# Altium schematic sheet Revision_Changes.SchDoc: TEBF0808 - Revision history
size A4; Organization: Trenz Electronic GmbH; DocumentNumber: TEBF0808; Revision: 04; SheetNumber: 36; SheetTotal: 36; Date: 2016-09-29; CompanyName: Trenz Electronic GmbH; PageSetup: Record=PageOptions|CenterHorizontal=True|CenterVertical=True|PrintScale=0.98|XCorrection=1.00|YCorrection=1.00|PrintKind=1|BorderSize=5000000|LeftOffset=0|BottomOffset=0|Orientation=2|PaperLength=1000|PaperWidth=1000|Scale=100|PaperSource=257|PrintQuality=600|MediaType=1|DitherType=10|PrintScaleMode=1|PaperKind=A4|PaperIndex=9
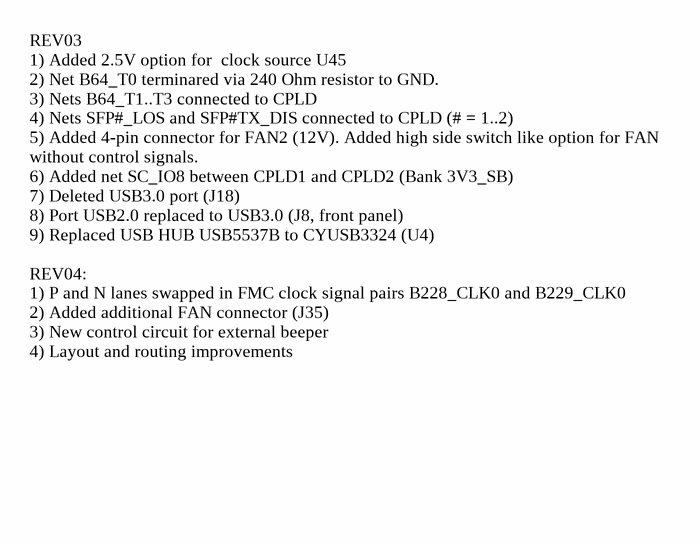
[diagram p0: Revision_Changes.SchDoc]

## Notes on the sheet
- REV03
  1) Added 2.5V option for  clock source U45
  2) Net B64_T0 terminared via 240 Ohm resistor to GND.
  3) Nets B64_T1..T3 connected to CPLD
  4) Nets SFP#_LOS and SFP#TX_DIS connected to CPLD (# = 1..2)
  5) Added 4-pin connector for FAN2 (12V). Added high side switch like option for FAN without control signals.
  6) Added net SC_IO8 between CPLD1 and CPLD2 (Bank 3V3_SB)
  7) Deleted USB3.0 port (J18)
  8) Port USB2.0 replaced to USB3.0 (J8, front panel)
  9) Replaced USB HUB USB5537B to CYUSB3324 (U4)
  REV04:
  1) P and N lanes swapped in FMC clock signal pairs B228_CLK0 and B229_CLK0
  2) Added additional FAN connector (J35)
  3) New control circuit for external beeper
  4) Layout and routing improvements
- Title:
- Number:
- Rev.
- Date:
- A4
- Copyright:
- Page
- of
- Filename: